# EasyEDA schematic SCH_HexaGlow Neon miner_2023-04-20.json

## Sheets
1 Motherboard: TITLE: Sheet_1; REV: 1.0; Date: 2023-04-19; Sheet: 1/1; Drawn By: abonion1500; Company: Your Company
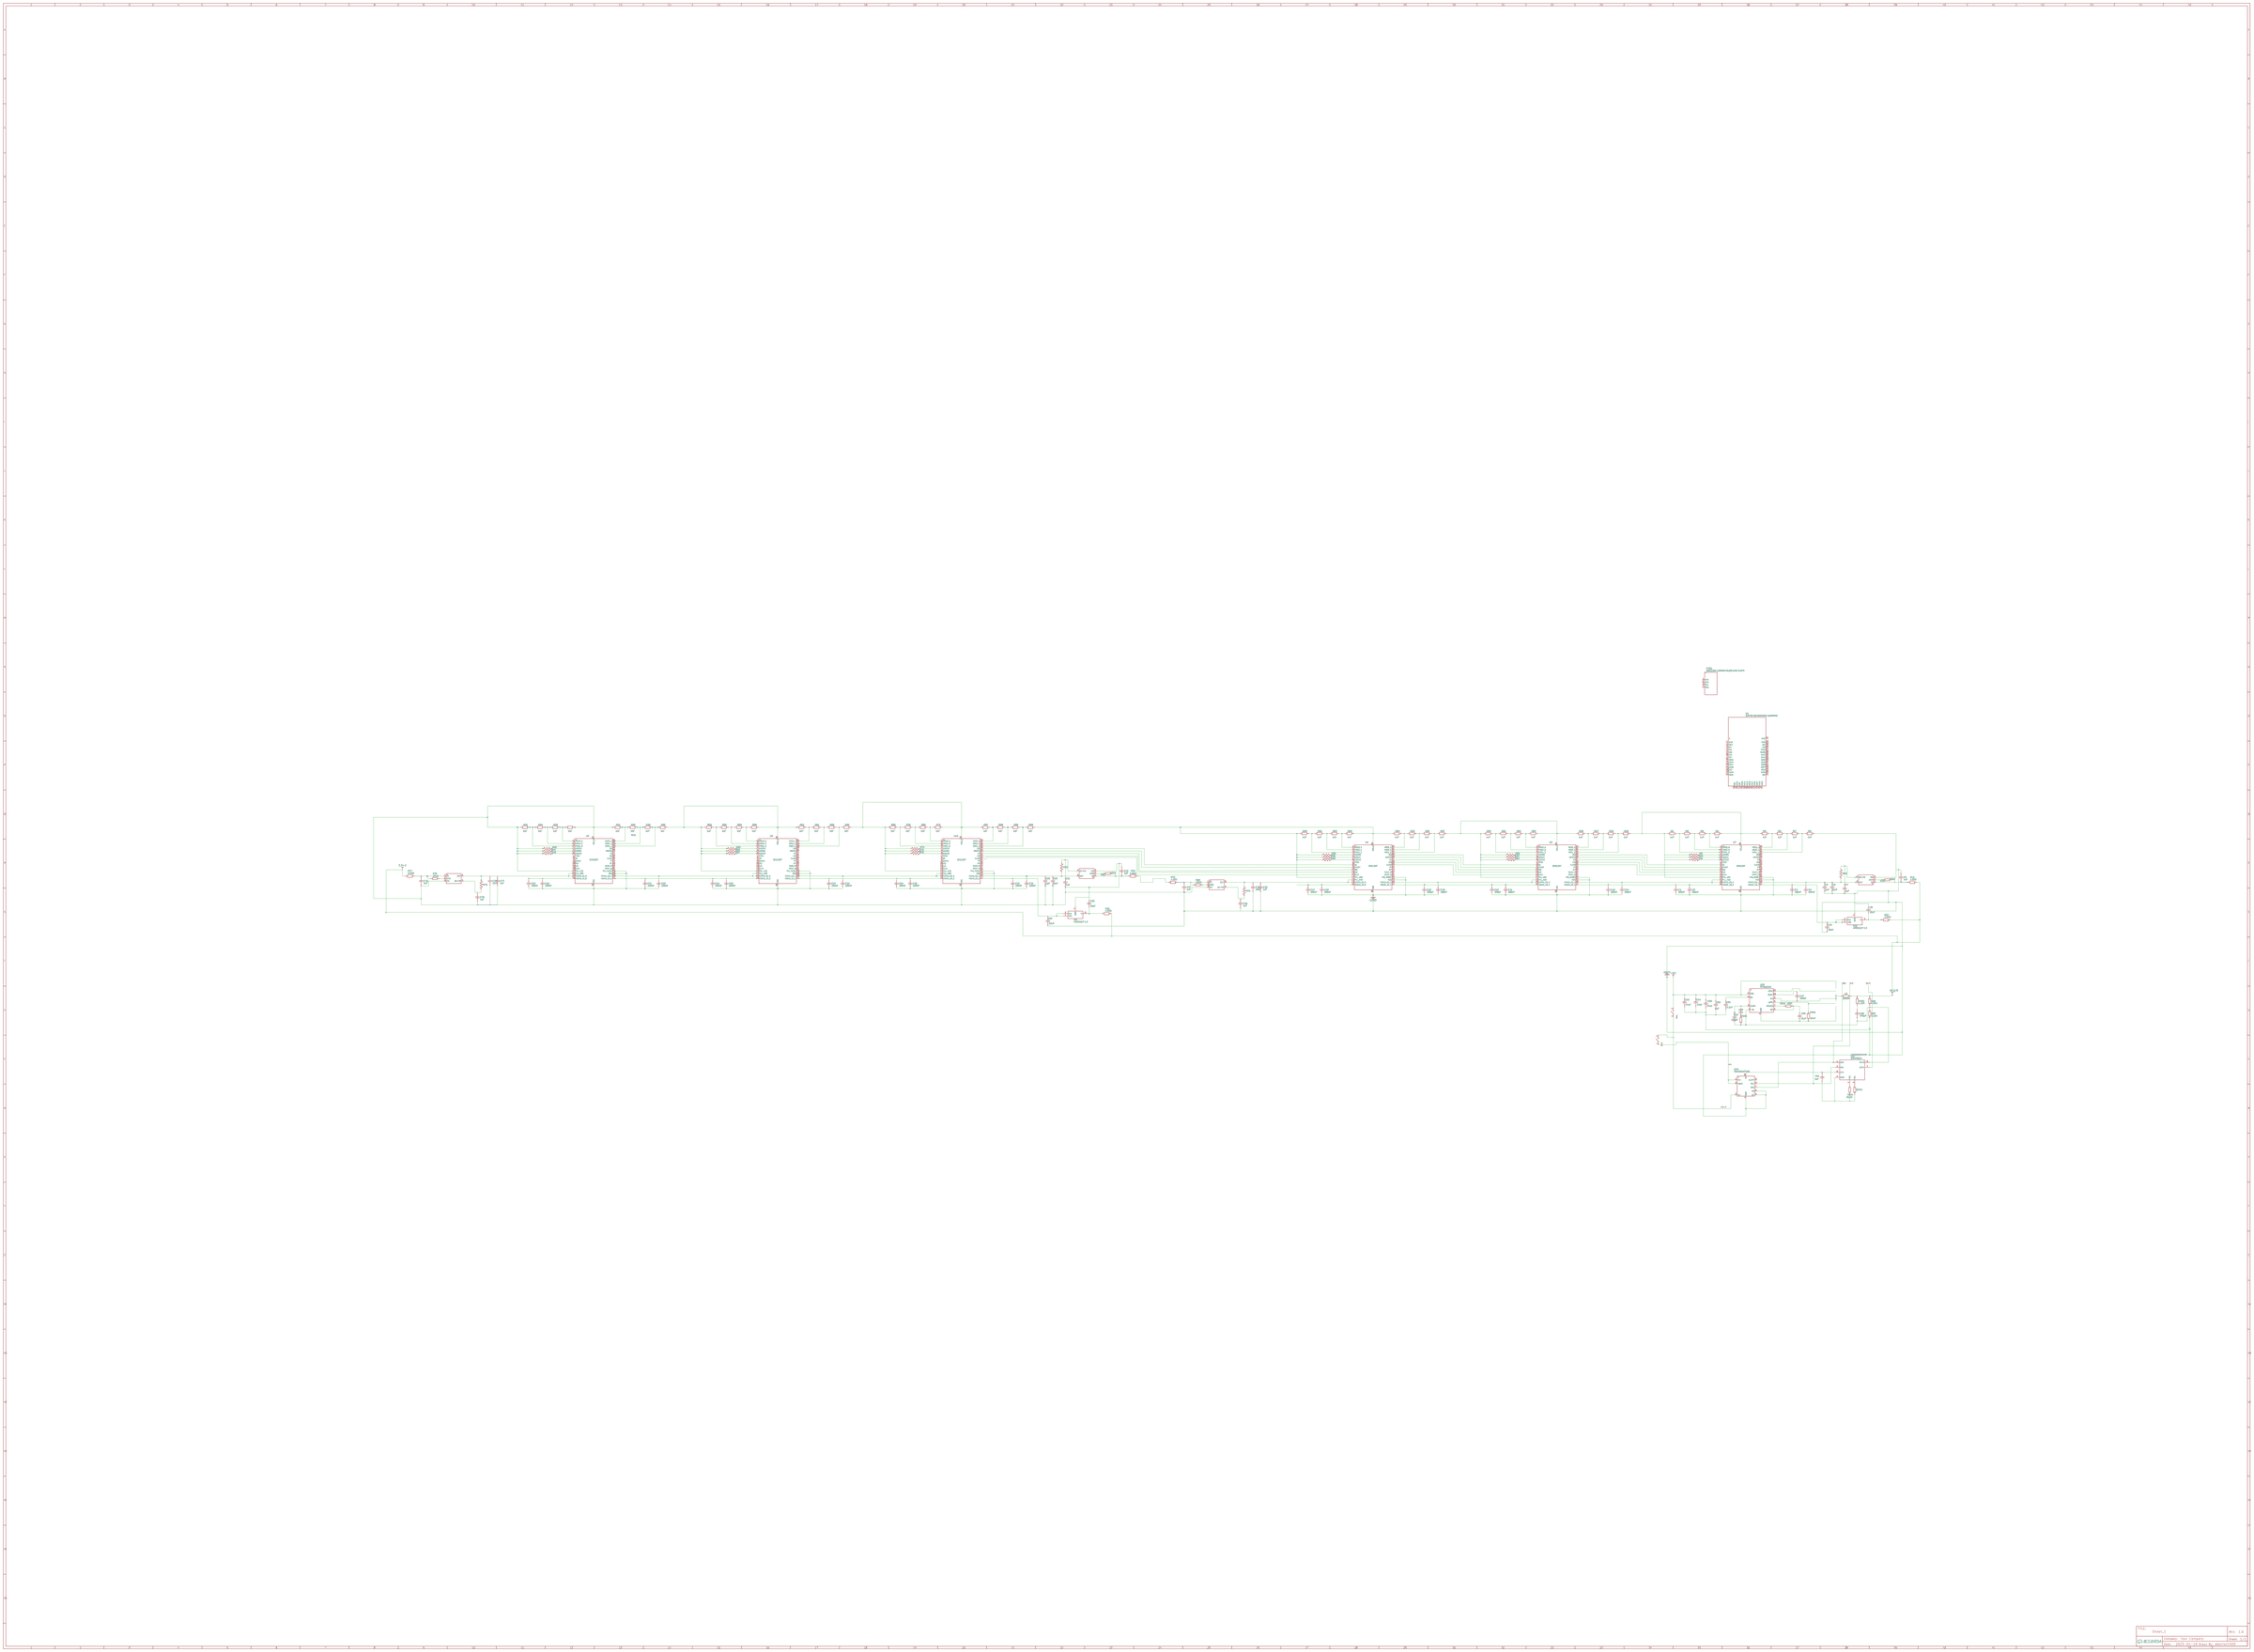
[diagram p0: Motherboard]
2 BM1397: TITLE: BM1397; Date: 2023-04-20; Drawn By: Abonion1500; Company: Abonion1500
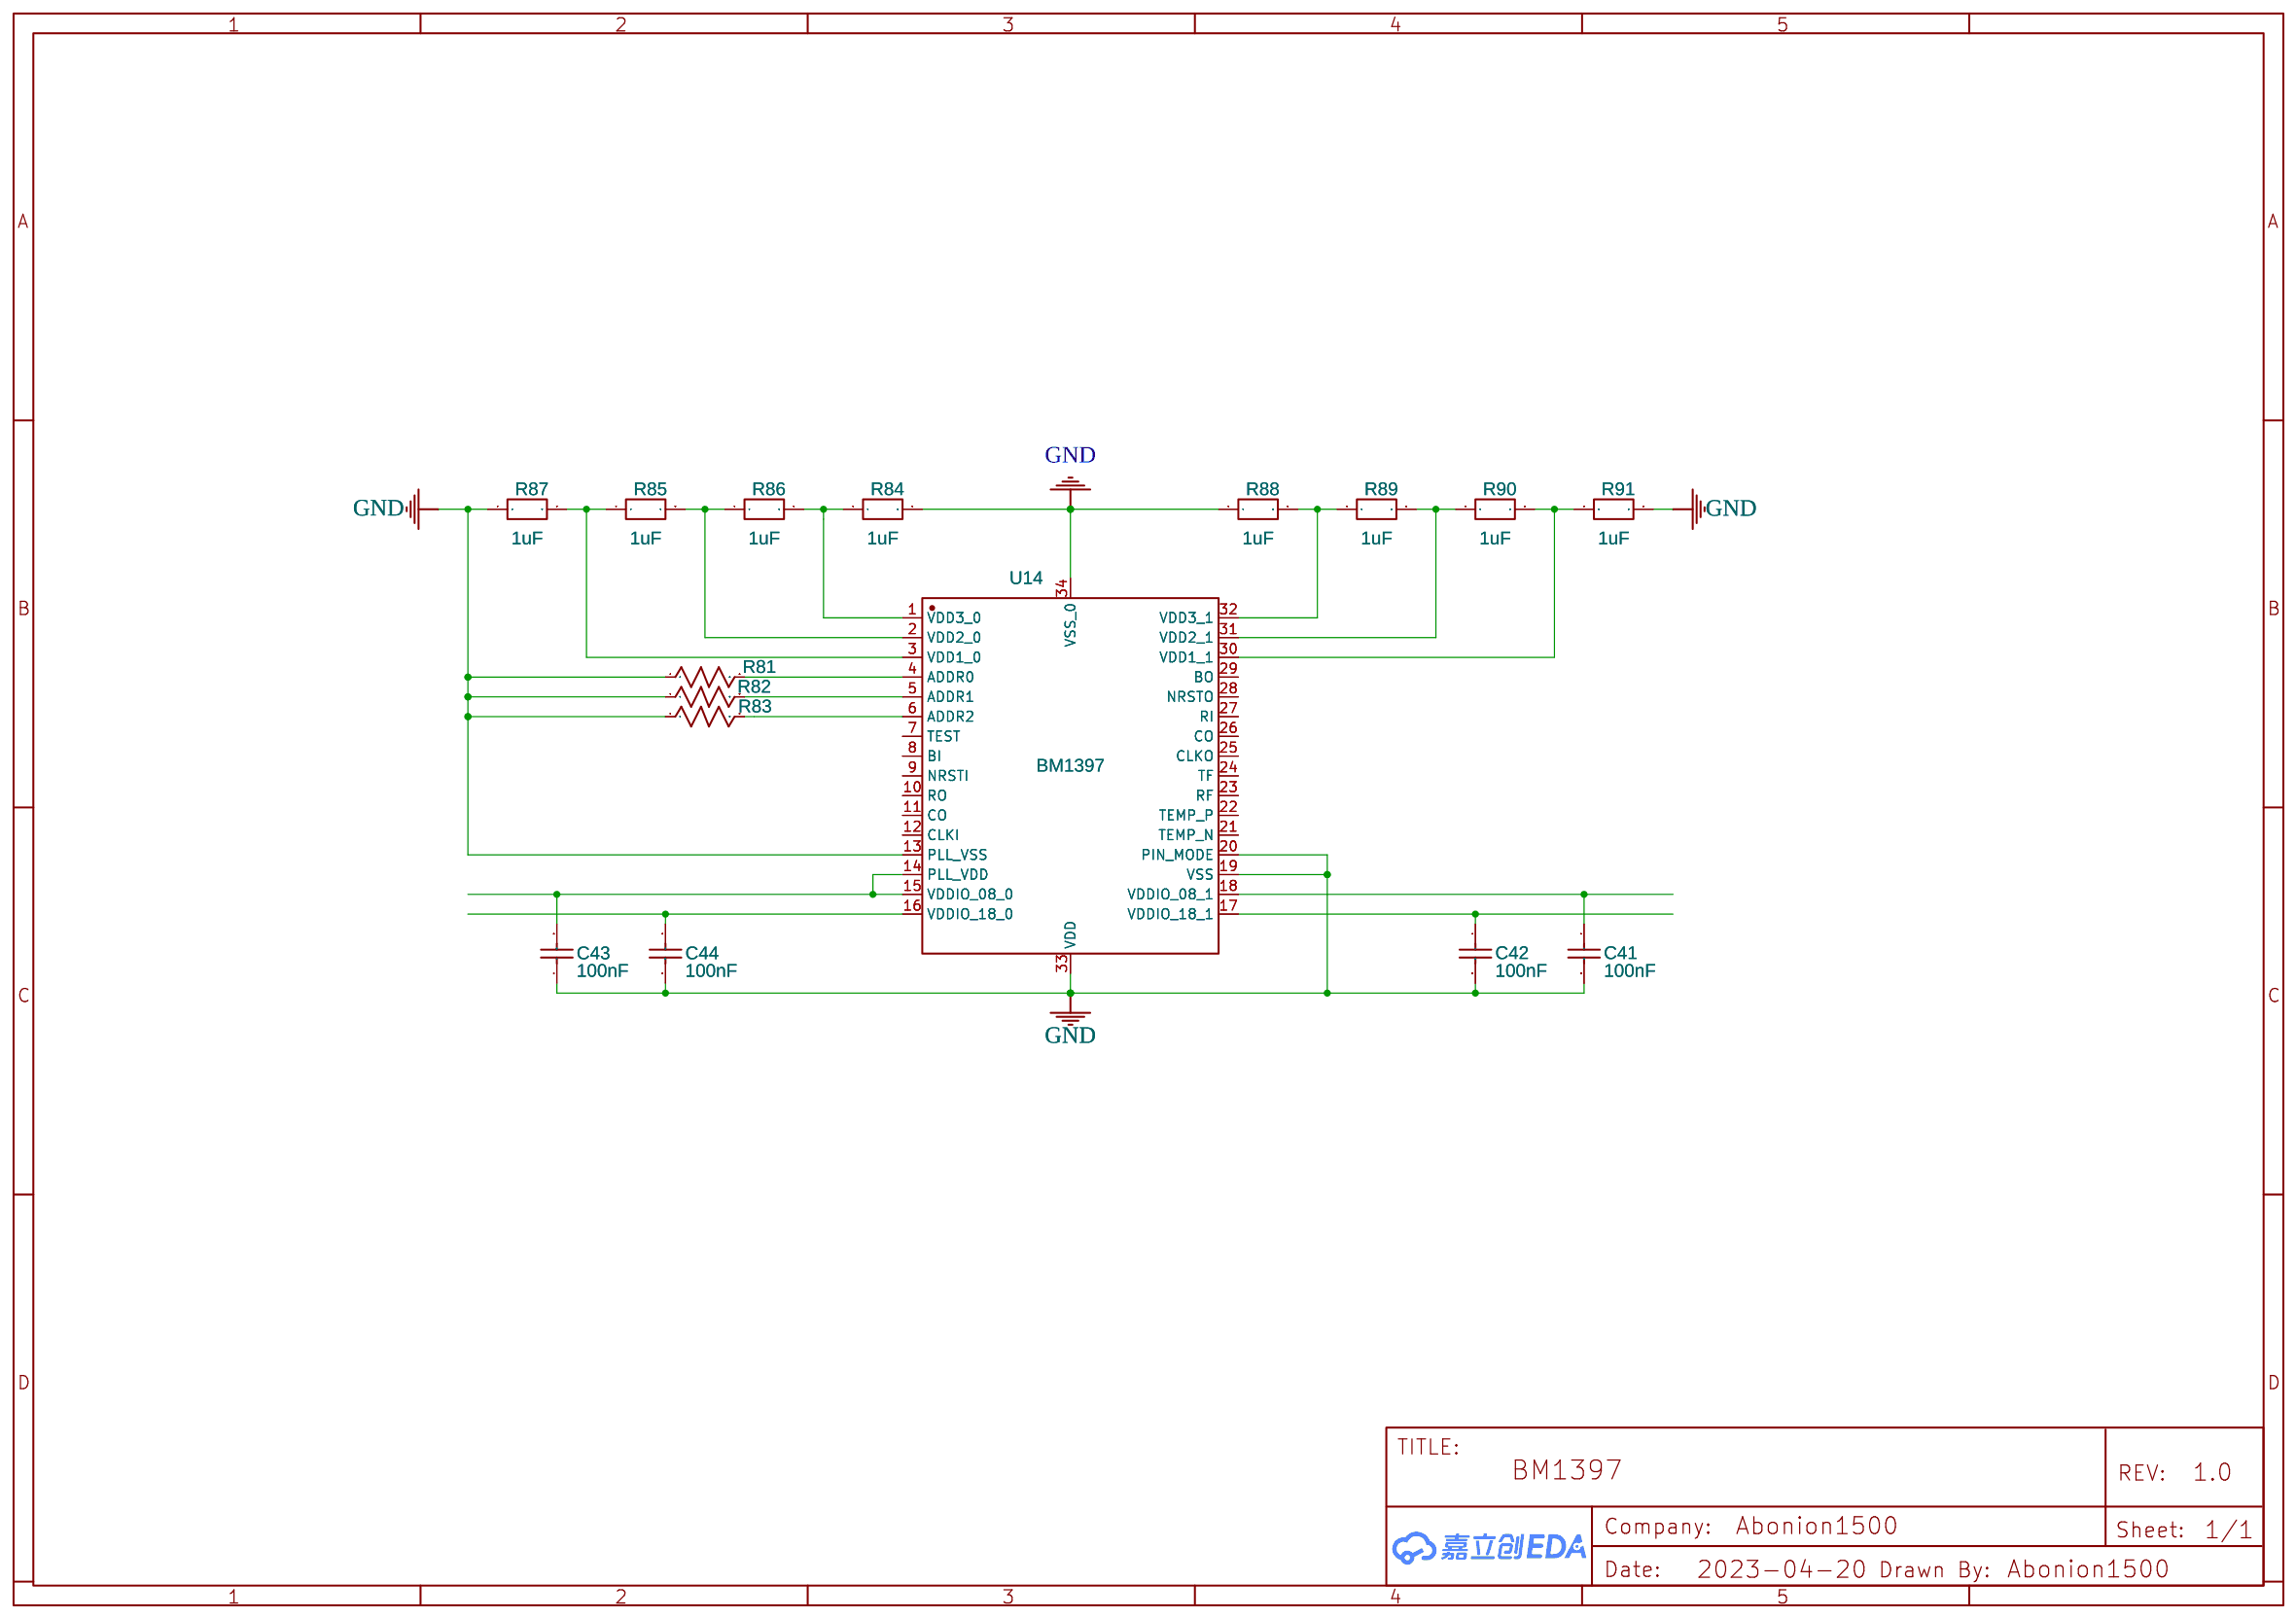
[diagram p1: BM1397]
3 Power: TITLE: Power; Date: 2023-04-20; Drawn By: Abonion1500; Company: Abonion1500
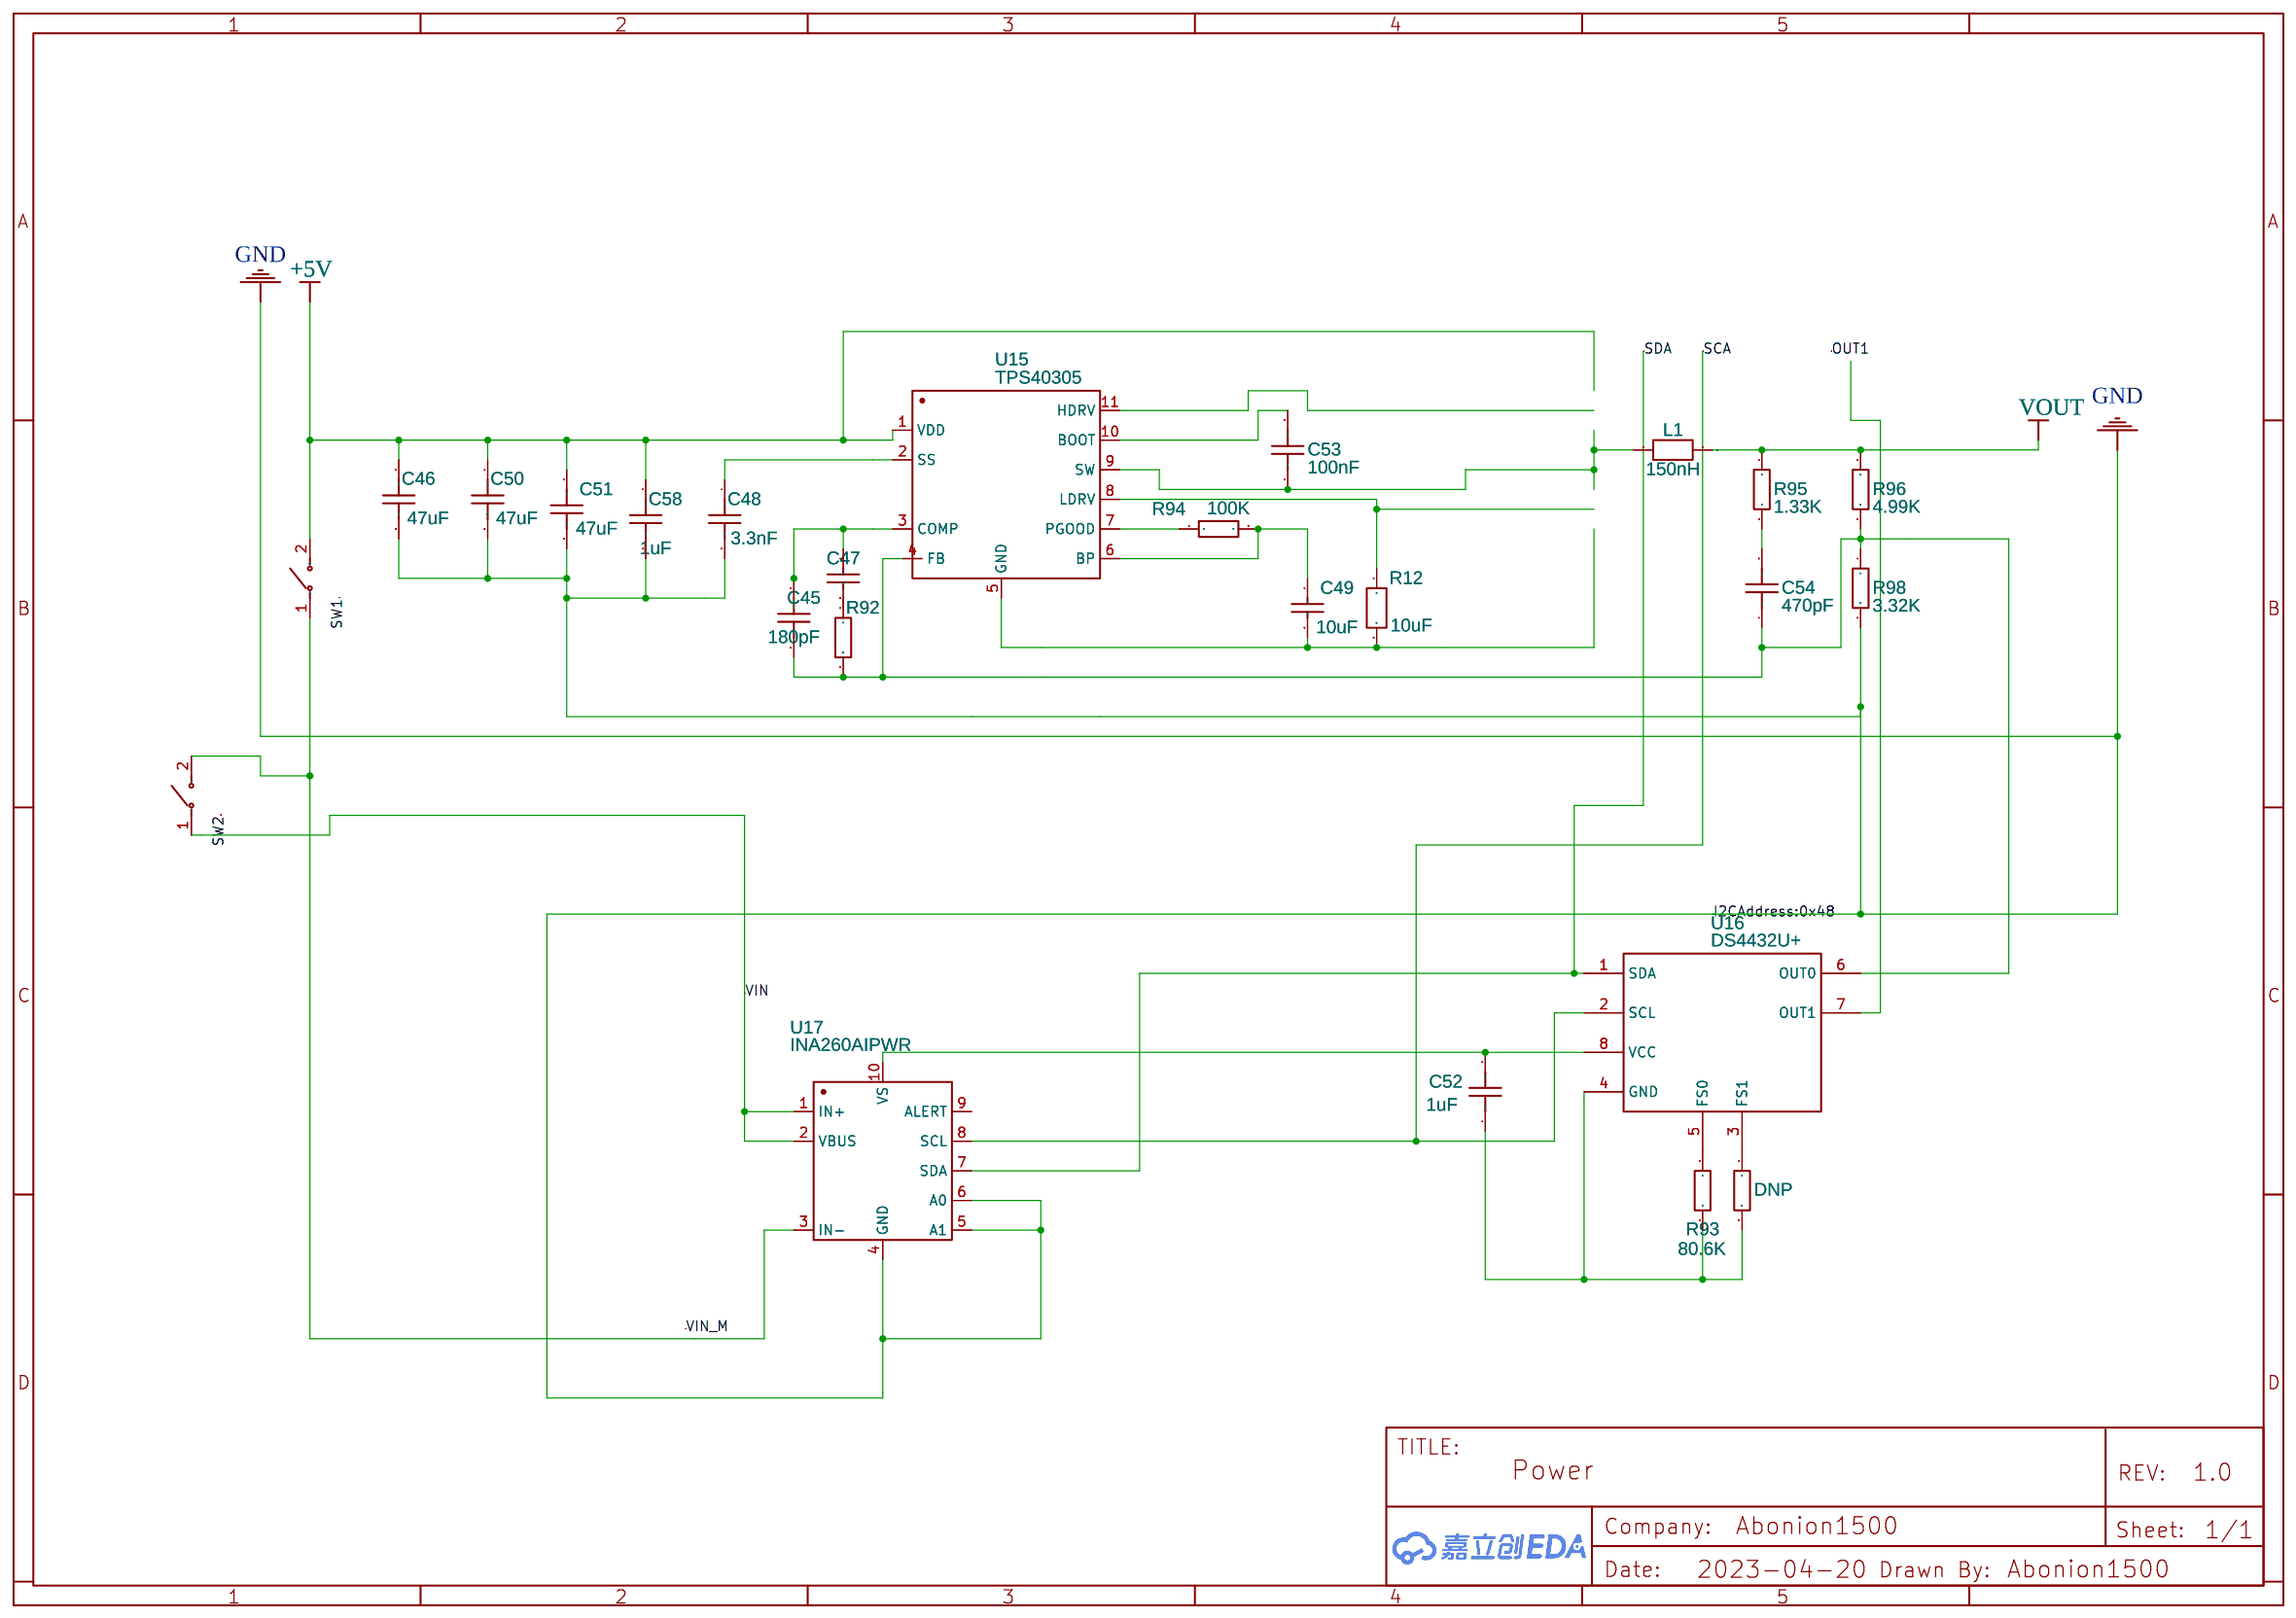
[diagram p2: Power]

## Parts
sheet BM1397
C41  100nF  [C0402]
C42  100nF  [C0402]
C43  100nF  [C0402]
C44  100nF  [C0402]
R81  RMCF0402ZT0R00  [R0402]
R82  RMCF0402ZT0R00  [R0402]
R83  RMCF0402ZT0R00  [R0402]
R84  1uF  [R0402]
R85  1uF  [R0402]
R86  1uF  [R0402]
R87  1uF  [R0402]
R88  1uF  [R0402]
R89  1uF  [R0402]
R90  1uF  [R0402]
R91  1uF  [R0402]
U14  BM1397  [BM1397]
sheet Motherboard
C1  100nF  [C0402]
C2  100nF  [C0402]
C3  100nF  [C0402]
C4  100nF  [C0402]
C5  1uF  [C0402]
C6  10nF  [C0402]
C7  1uF  [C0402]
C8  1uF  [C0402]
C9  10uF  [C0805]
C10  22uF  [C1206]
C11  100nF  [C0402]
C12  100nF  [C0402]
C13  100nF  [C0402]
C14  100nF  [C0402]
C15  100nF  [C0402]
C16  100nF  [C0402]
C17  100nF  [C0402]
C18  100nF  [C0402]
C19  100nF  [C0402]
C20  100nF  [C0402]
C21  100nF  [C0402]
C22  100nF  [C0402]
C23  100nF  [C0402]
C24  100nF  [C0402]
C25  100nF  [C0402]
C26  100nF  [C0402]
C27  22uF  [C1206]
C28  10uF  [C0805]
C29  10nF  [C0402]
C30  1uF  [C0402]
C31  1uF  [C0402]
C32  1uF  [C0402]
C33  100nF  [C0402]
C34  100nF  [C0402]
C35  100nF  [C0402]
C36  100nF  [C0402]
C37  1uF  [C0402]
C38  1uF  [C0402]
C39  10nF  [C0402]
C40  1uF  [C0402]
C55  470pF  [C0805]
C56  10uF  [C0805]
C57  100nF  [C0402]
C59  1.5nF  [C0805]
C60  180pF  [C0805]
C61  1uF  [C0402]
C62  1uF  [C0402]
C63  47uF  [C1210]
C64  47uF  [C1210]
C65  3.3nF  [C0402]
C66  47uF  [C1210]
C76  1uF  [C0402]
C77  1uF  [C0402]
C78  10nF  [C0402]
C79  1uF  [C0402]
DNP1  80.6K  [R0402]
L2  150nH
PCB1  SSD1306-128X64-OLED-0.96 COPY  [SSD1306]
R1  1uF  [R0402]
R2  1uF  [R0402]
R3  1uF  [R0402]
R4  1uF  [R0402]
R5  1uF  [R0402]
R6  1uF  [R0402]
R7  1uF  [R0402]
R8  1uF  [R0402]
R9  RMCF0402ZT0R00  [R0402]
R10  RMCF0402ZT0R00  [R0402]
R11  RMCF0402ZT0R00  [R0402]
R12  RMCF0402ZT0R00  [R0402]
R13  10kΩ  [R1206]
R14  4.99Ω  [R2512]
R15  1uF  [R0402]
R16  1uF  [R0402]
R17  1uF  [R0402]
R18  1uF  [R0402]
R19  1uF  [R0402]
R20  1uF  [R0402]
R21  1uF  [R0402]
R22  1uF  [R0402]
R23  RMCF0402ZT0R00  [R0402]
R24  RMCF0402ZT0R00  [R0402]
R25  RMCF0402ZT0R00  [R0402]
R26  RMCF0402ZT0R00  [R0402]
R27  4.99Ω  [R2512]
R28  RMCF0402ZT0R00  [R0402]
R29  RMCF0402ZT0R00  [R0402]
R30  1uF  [R0402]
R31  1uF  [R0402]
R32  1uF  [R0402]
R33  1uF  [R0402]
R34  1uF  [R0402]
R35  1uF  [R0402]
R36  1uF  [R0402]
R37  1uF  [R0402]
R38  1uF  [R0402]
R39  1uF  [R0402]
R40  1uF  [R0402]
R41  1uF  [R0402]
R42  1uF  [R0402]
R43  1uF  [R0402]
R44  1uF  [R0402]
R45  1uF  [R0402]
R46  RMCF0402ZT0R00  [R0402]
R47  RMCF0402ZT0R00  [R0402]
R48  RMCF0402ZT0R00  [R0402]
R49  1uF  [R0402]
R50  1uF  [R0402]
R51  1uF  [R0402]
R52  1uF  [R0402]
R53  1uF  [R0402]
R54  1uF  [R0402]
R55  1uF  [R0402]
R56  1uF  [R0402]
R57  RMCF0402ZT0R00  [R0402]
R58  RMCF0402ZT0R00  [R0402]
R59  RMCF0402ZT0R00  [R0402]
R60  4.99Ω  [R2512]
R61  10kΩ  [R1206]
R62  RMCF0402ZT0R00  [R0402]
R63  4.99Ω  [R2512]
R64  1uF  [R0402]
R65  1uF  [R0402]
R66  1uF  [R0402]
R67  1uF  [R0402]
R68  1uF  [R0402]
R69  1uF  [R0402]
R70  1uF  [R0402]
R71  1uF  [R0402]
R72  RMCF0402ZT0R00  [R0402]
R73  RMCF0402ZT0R00  [R0402]
R74  RMCF0402ZT0R00  [R0402]
R75  10kΩ  [R1206]
R76  RMCF0402ZT0R00  [R0402]
R77  4.99Ω  [R2512]
R78  4.99Ω  [R2512]
R79  RMCF0402ZT0R00  [R0402]
R80  10kΩ  [R1206]
R97  3.32K  [R0402]
R99  4.99K  [R0402]
R100  1.33K  [R0402]
R101  10uF  [R0402]
R102  100K  [R0402]
R103  3.83K  [R0402]
R104  80.6K  [R0402]
SW3  Switch_Connector  [SWITCH_CONNECTOR]
SW4  Switch_Connector  [SWITCH_CONNECTOR]
U1  ESP32-S3-WROOM-1(N16R8)  [WIRELM-SMD_ESP32-S3-WROOM-1]
U2  SGM2036-0.8YN5G/TR  [SOT-23-5_L2.9-W1.6-P0.95-LS2.8-BR]
U3  BM1397  [BM1397]
U4  BM1397  [BM1397]
U5  BM1397  [BM1397]
U6  BM1397  [BM1397]
U7  BM1397  [BM1397]
U8  AMS1117-1.8  [SOT-223-4_L6.5-W3.5-P2.30-LS7.0-BR]
U9  SGM2036-0.8YN5G/TR  [SOT-23-5_L2.9-W1.6-P0.95-LS2.8-BR]
U10  BM1397  [BM1397]
U11  AMS1117-1.8  [SOT-223-4_L6.5-W3.5-P2.30-LS7.0-BR]
U12  SGM2036-0.8YN5G/TR  [SOT-23-5_L2.9-W1.6-P0.95-LS2.8-BR]
U13  SGM2036-0.8YN5G/TR  [SOT-23-5_L2.9-W1.6-P0.95-LS2.8-BR]
U18  TPS40305
U19  INA260AIPWR
U20  DS4432U+  [USOP-8]
sheet Power
C45  180pF  [C0805]
C46  47uF  [C1210]
C47  1.5nF  [C0805]
C48  3.3nF  [C0402]
C49  10uF  [C0805]
C50  47uF  [C1210]
C51  47uF  [C1210]
C52  1uF  [C0402]
C53  100nF  [C0402]
C54  470pF  [C0805]
C58  1uF  [C0402]
DNP  80.6K  [R0402]
L1  150nH
R12#2  10uF  [R0402]
R92  3.83K  [R0402]
R93  80.6K  [R0402]
R94  100K  [R0402]
R95  1.33K  [R0402]
R96  4.99K  [R0402]
R98  3.32K  [R0402]
SW1  Switch_Connector  [SWITCH_CONNECTOR]
SW2  Switch_Connector  [SWITCH_CONNECTOR]
U15  TPS40305
U16  DS4432U+  [USOP-8]
U17  INA260AIPWR

## Library data of the parts
C1-C4 C11-C26 C33-C36 C41-C44 = CC0402KRX5R7BB104: Supplier: LCSC; Supplier Part: C106204; Manufacturer: YAGEO(国巨); Contributor: LCSC; JLCPCB Part Class: Extended Part
R9-R12 R23-R26 R28 R29 R46-R48 R57-R59 R62 R72-R74 R76 R79 R81-R83 = RMCF0402ZT0R00: Manufacturer: Stackpole Electronics Inc; Supplier: Digi-Key; Supplier Part: RMCF0402ZT0R00CT-ND; link: https://www.digikey.ca/fr/products/detail/stackpole-electronics-inc/RMCF0402ZT0R00/1756905; Contributor: deserresalex
R1-R8 R15-R22 R30-R45 R49-R56 R64-R71 R84-R91 = 0402: Supplier: LCSC; Supplier Part: C730425; Manufacturer: Samsung Electro-Mechanics; Manufacturer Part: CL05A105MO5NNNC; JLCPCB Part Class: Resistor; Contributor: abonion1500; Package Display: No
U3-U7 U10 U14 = BM1397: Contributor: abonion1500
C5 C7 C8 C30-C32 C37 C38 C40 C52 C58 C61 C62 C76 C77 C79 = CGA2B1X7T0G105M050BC: Supplier: LCSC; Supplier Part: C2174522; Manufacturer: TDK; link: https://atta.szlcsc.com/upload/public/pdf/source/20210430/BD8671736ED62E65BA506F30C3AAED50.pdf; Contributor: lcsc
C6 C29 C39 C78 = CC0402KRX7R7BB103: Supplier: LCSC; Supplier Part: C327009; Manufacturer: YAGEO(国巨); Contributor: LCSC; JLCPCB Part Class: Extended Part
C9 C28 C49 C56 = CL21A106KOQNNNE: Supplier: LCSC; Manufacturer: SAMSUNG(三星); Supplier Part: C1713; JLCPCB Part Class: Extended Part
C10 C27 = CL31A226KOHNNNE: Supplier: LCSC; Manufacturer: SAMSUNG(三星); Supplier Part: C90146; JLCPCB Part Class: Extended Part
C54 C55 = 0805B471K500CT: Supplier: LCSC; Supplier Part: C338123; Manufacturer: Walsin(华新科); Contributor: LCSC; JLCPCB Part Class: Extended Part
C53 C57 = 0402X104K100CT: Supplier: LCSC; Supplier Part: C387958; Manufacturer: Walsin(华新科); Contributor: LCSC; JLCPCB Part Class: Extended Part
C47 C59 = CC0805KRX7R9BB152: Supplier: LCSC; Manufacturer: YAGEO(国巨); Supplier Part: C107142; JLCPCB Part Class: Extended Part
C45 C60 = CC0805JRNPO9BN181: Supplier: LCSC; Supplier Part: C113826; Manufacturer: YAGEO(国巨); Contributor: LCSC; JLCPCB Part Class: Extended Part
C46 C50 C51 C63 C64 C66 = GRM32ER61C476KE15L: Supplier: LCSC; Manufacturer: muRata(村田); Supplier Part: C77101; JLCPCB Part Class: Extended Part
C48 C65 = CL05B332KB5NNNC: Supplier: LCSC; Manufacturer: SAMSUNG(三星); Supplier Part: C26404; JLCPCB Part Class: Basic Part
DNP DNP1 R93 R104 = RC0402FR-0780K6L: Supplier: LCSC; Manufacturer: YAGEO(国巨); Contributor: LCSC; Supplier Part: C155698; JLCPCB Part Class: Extended Part; Resistance: 80.6kΩ
L1 L2 = FP1005R1-R15-R: Contributor: abonion1500; Package Display: No
PCB1 = SSD1306-128X64-OLED-0.96 COPY: sourceId: wICUcuL3l
R13 R61 R75 R80 = 1206W4F1002T5E: Supplier: LCSC; Manufacturer: UNI-ROYAL(厚声); Supplier Part: C17902; Resistance (Ohms): 10K; JLCPCB Part Class: Basic Part
R14 R27 R60 R63 R77 R78 = 25121WF499KT4E: Supplier: LCSC; Supplier Part: C406933; Manufacturer: UNI-ROYAL(厚声); Resistance (Ohms): 4.99; Contributor: LCSC; JLCPCB Part Class: Extended Part
R97 R98 = RC0402FR-073K32L: Supplier: LCSC; Manufacturer: YAGEO(国巨); Supplier Part: C137993; JLCPCB Part Class: Extended Part; Resistance: 3.32kΩ
R96 R99 = RC0402FR-074K99L: Supplier: LCSC; Manufacturer: YAGEO(国巨); Supplier Part: C137965; JLCPCB Part Class: Extended Part; Resistance: 4.99kΩ
R95 R100 = RC0402FR-071K33L: Supplier: LCSC; Supplier Part: C276261; Manufacturer: YAGEO(国巨); Contributor: LCSC; Resistance: 1.33kΩ; JLCPCB Part Class: Extended Part
R12#2 R101 = 0402: Supplier: Digi-Key; Supplier Part: C9900015844; Manufacturer: null; JLCPCB Part Class: Extended Part; Contributor: abonion1500
R94 R102 = RC0402JR-07100KL: Supplier: LCSC; Manufacturer: YAGEO(国巨); Supplier Part: C106234; JLCPCB Part Class: Extended Part; Resistance: 100kΩ
R92 R103 = RC0402FR-073K83L: Supplier: LCSC; Supplier Part: C185417; Manufacturer: YAGEO(国巨); Contributor: LCSC; JLCPCB Part Class: Extended Part; Resistance: 3.83kΩ
SW1-SW4 = Switch_Connector: Supplier: LCSC; Supplier Part: C2890356; Manufacturer: G-Switch(品赞); Manufacturer Part: GT-TCB73B-H043-L1; Contributor: sourabh jawalkar
U1 = ESP32-S3-WROOM-1(N16R8): Supplier: LCSC; Supplier Part: C2913202; Manufacturer: ESPRESSIF(乐鑫); Manufacturer Part: ESP32-S3-WROOM-1-N16R8; link: https://atta.szlcsc.com/upload/public/pdf/source/20220705/4E799F39581577F766659887F738A439.pdf; JLCPCB Part Class: Extended Part; Contributor: lcsc
U2 U9 U12 U13 = SGM2036-0.8YN5G/TR: Supplier: LCSC; Supplier Part: C700345; Manufacturer: SGMICRO(圣邦微); link: https://atta.szlcsc.comnull; Contributor: lcsc; JLCPCB Part Class: Extended Part
U8 U11 = AMS1117-1.8: Supplier: LCSC; Manufacturer: AMS; Supplier Part: C6185; JLCPCB Part Class: Extended Part
U15 U18 = TPS40305: Contributor: abonion1500
U17 U19 = INA260AIPWR: Manufacturer: Texas Instruments; Supplier: Digi-Key; Supplier Part: 296-47777-1-ND; Contributor: abonion1500
U16 U20 = DS4432U+: Manufacturer: Maxim Integrated; Supplier: Mouser; Supplier Part: 700-DS4432U; link: https://www.mouser.com/ProductDetail/Maxim-Integrated/DS4432U%2b?qs=sGAEpiMZZMswix2y39yldXm0IcSzou4VXfQNwe0ImdY%3D; Contributor: wheetcracker

## Nets
3.3v-1: R14.1 R27.2 R60.2 R77.1 R95.1 R96.1 R99.1 R100.1
+5V: C46.1 C50.1 C51.1 C58.2 C62.2 C63.1 C64.1 C66.1 SW2.2 SW3.2 U15.1(VDD) U18.1(VDD)
GND: C1.1 C2.1 C3.2 C4.2 C5.2 C6.1 C7.2 C8.1 C9.2 C10.1 C11.1 C12.1 C13.2 C14.2 C15.2 C16.2 C17.1 C18.1 C19.1 C20.1 C21.2 C22.2 C23.1 C24.1 C25.2 C26.2 C27.1 C28.2 C29.1 C30.2 C31.2 C32.1 C33.1 C34.1 C35.2 C36.2 C37.1 C38.1 C39.2 C40.1 C41.2 C42.2 C43.1 C44.1 C46.2 C48.2 C50.2 C51.2 C58.1 C62.1 C63.2 C64.2 C65.2 C66.2 C76.1 C77.1 C78.2 C79.1 R8.2 R41.1 R42.1 R45.2 R46.1 R47.1 R48.1 R81.1 R82.1 R83.1 R84.2 R87.1 R88.1 R91.2 R97.2 R98.2 U2.3(EN) U3.19(VSS) U3.20(PIN_MODE) U3.33(VDD) U4.19(VSS) U4.20(PIN_MODE) U4.33(VDD) U5.13(PLL_VSS) U5.19(VSS) U5.20(PIN_MODE) U5.33(VDD) U5.34(VSS_0) U6.19(VSS) U6.20(PIN_MODE) U6.33(VDD) U7.19(VSS) U7.20(PIN_MODE) U7.33(VDD) U8.1(GND) U9.3(EN) U10.19(VSS) U10.20(PIN_MODE) U10.33(VDD) U11.1(GND) U12.3(EN) U13.3(EN) U14.13(PLL_VSS) U14.19(VSS) U14.20(PIN_MODE) U14.33(VDD) U14.34(VSS_0) U17.4(GND) U17.5(A1) U17.6(A0) U19.4(GND) U19.5(A1) U19.6(A0)
VIN: SW1.1 SW4.1 U17.1(IN+) U17.2(VBUS) U19.1(IN+) U19.2(VBUS)
SCA: U16.2(SCL) U17.8(SCL) U19.8(SCL) U20.2(SCL)
SDA: U16.1(SDA) U17.7(SDA) U19.7(SDA) U20.1(SDA)
Net-(C1-2): C1.2 C2.2 C13.1 U3.17(VDDIO_18_1) U7.16(VDDIO_18_0)
Net-(C3-1): C3.1 C10.2 U7.17(VDDIO_18_1) U11.2(Out) U11.4(TAB)
Net-(C4-1): C4.1 C5.1 C6.2 R12.2 U2.5(OUT) U7.18(VDDIO_08_1)
Net-(C7-1): C7.1 R12.1 U2.4(BP/FB)
Net-(C8-2): C8.2 R13.1 R14.2 U2.1(IN)
Net-(C9-1): C9.1 R27.1 U11.3(In)
Net-(C11-2): C11.2 C12.2 C16.1 U3.16(VDDIO_18_0) U4.17(VDDIO_18_1)
Net-(C14-1): C14.1 U3.18(VDDIO_08_1) U7.14(PLL_VDD) U7.15(VDDIO_08_0)
Net-(C15-1): C15.1 U3.14(PLL_VDD) U3.15(VDDIO_08_0) U4.18(VDDIO_08_1)
Net-(C17-2): C17.2 C18.2 U4.16(VDDIO_18_0)
Net-(C19-2): C19.2 C20.2 U5.16(VDDIO_18_0)
Net-(C21-1): C21.1 C23.2 C24.2 U5.17(VDDIO_18_1) U6.16(VDDIO_18_0)
Net-(C22-1): C22.1 U5.18(VDDIO_08_1) U6.14(PLL_VDD) U6.15(VDDIO_08_0)
Net-(C25-1): C25.1 C33.2 C34.2 U6.17(VDDIO_18_1) U10.16(VDDIO_18_0)
Net-(C26-1): C26.1 U6.18(VDDIO_08_1) U10.14(PLL_VDD) U10.15(VDDIO_08_0)
Net-(C27-2): C27.2 C35.1 U8.2(Out) U8.4(TAB) U10.17(VDDIO_18_1)
Net-(C28-1): C28.1 R60.1 U8.3(In)
Net-(C31-1): C31.1 R62.1 U9.4(BP/FB)
Net-(C32-2): C32.2 R61.1 R63.2 U9.1(IN)
Net-(C36-1): C36.1 R62.2 U9.5(OUT) U10.18(VDDIO_08_1)
Net-(C37-2): C37.2 R78.2 R80.1 U13.1(IN)
Net-(C41-1): C41.1 U14.18(VDDIO_08_1)
Net-(C42-1): C42.1 U14.17(VDDIO_18_1)
Net-(C43-2): C43.2 U14.14(PLL_VDD) U14.15(VDDIO_08_0)
Net-(C44-2): C44.2 U14.16(VDDIO_18_0)
Net-(C45-1): C45.1 C47.1 U15.3(COMP)
Net-(C45-2): C45.2 C54.1 R92.2 R96.2 R98.1 U15.4(FB) U16.6(OUT0)
Net-(C47-2): C47.2 R92.1
Net-(C48-1): C48.1 U15.2(SS)
Net-(C49-1): C49.1 R94.2 U15.6(BP)
Net-(C49-2): C49.2 R12#2.2 U15.5(GND)
Net-(C52-1): C52.1 DNP.2 R93.2 U16.4(GND)
Net-(C52-2): C52.2 U16.8(VCC) U17.10(VS)
Net-(C53-1): C53.1 U15.9(SW)
Net-(C53-2): C53.2 U15.10(BOOT)
Net-(C54-2): C54.2 R95.2
Net-(C55-1): C55.1 C60.2 R97.1 R99.2 R103.2 U18.4(FB) U20.6(OUT0)
Net-(C55-2): C55.2 R100.2
Net-(C56-1): C56.1 R102.2 U18.6(BP)
Net-(C56-2): C56.2 R101.2 U18.5(GND)
Net-(C57-1): C57.1 U18.9(SW)
Net-(C57-2): C57.2 U18.10(BOOT)
Net-(C59-1): C59.1 C60.1 U18.3(COMP)
Net-(C59-2): C59.2 R103.1
Net-(C61-1): C61.1 DNP1.2 R104.2 U20.4(GND)
Net-(C61-2): C61.2 U19.10(VS) U20.8(VCC)
Net-(C65-1): C65.1 U18.2(SS)
Net-(C76-2): C76.2 R75.1 R77.2 U12.1(IN)
Net-(DNP1-1): DNP1.1 U20.3(FS1)
Net-(DNP-1): DNP.1 U16.3(FS1)
Net-(R1-1): R1.1 R4.2 R5.1 R15.2 U7.13(PLL_VSS) U7.34(VSS_0)
Net-(R1-2): R1.2 R2.1 U7.3(VDD1_0)
Net-(R2-2): R2.2 R3.1 U7.2(VDD2_0)
Net-(R3-2): R3.2 R4.1 U7.1(VDD3_0)
Net-(R5-2): R5.2 R6.1 U7.32(VDD3_1)
Net-(R6-2): R6.2 R7.1 U7.31(VDD2_1)
Net-(R7-2): R7.2 R8.1 U7.30(VDD1_1)
Net-(R9-2): R9.2 U7.4(ADDR0)
Net-(R10-2): R10.2 U7.5(ADDR1)
Net-(R11-2): R11.2 U7.6(ADDR2)
Net-(R12#2-1): R12#2.1 U15.8(LDRV)
Net-(R13-2): R13.2 U2.2(GND)
Net-(R15-1): R15.1 R16.2 U3.30(VDD1_1)
Net-(R16-1): R16.1 R17.2 U3.31(VDD2_1)
Net-(R17-1): R17.1 R18.2 U3.32(VDD3_1)
Net-(R18-1): R18.1 R19.1 R22.2 R23.1 R24.1 R25.1 R37.2 U3.13(PLL_VSS) U3.34(VSS_0)
Net-(R19-2): R19.2 R21.1 U3.3(VDD1_0)
Net-(R20-1): R20.1 R21.2 U3.2(VDD2_0)
Net-(R20-2): R20.2 R22.1 U3.1(VDD3_0)
Net-(R23-2): R23.2 U3.6(ADDR2)
Net-(R24-2): R24.2 U3.5(ADDR1)
Net-(R25-2): R25.2 U3.4(ADDR0)
Net-(R26-1): R26.1 R28.1 R29.1 R30.2 R33.1 R34.1 R64.2 U4.13(PLL_VSS) U4.34(VSS_0)
Net-(R26-2): R26.2 U4.4(ADDR0)
Net-(R28-2): R28.2 U4.5(ADDR1)
Net-(R29-2): R29.2 U4.6(ADDR2)
Net-(R30-1): R30.1 R32.2 U4.1(VDD3_0)
Net-(R31-1): R31.1 R33.2 U4.3(VDD1_0)
Net-(R31-2): R31.2 R32.1 U4.2(VDD2_0)
Net-(R34-2): R34.2 R35.1 U4.32(VDD3_1)
Net-(R35-2): R35.2 R36.1 U4.31(VDD2_1)
Net-(R36-2): R36.2 R37.1 U4.30(VDD1_1)
Net-(R38-1): R38.1 R39.2 U5.30(VDD1_1)
Net-(R38-2): R38.2 R52.1 R53.1 R56.2 R57.1 R58.1 R59.1 U6.13(PLL_VSS) U6.34(VSS_0)
Net-(R39-1): R39.1 R40.2 U5.31(VDD2_1)
Net-(R40-1): R40.1 R41.2 U5.32(VDD3_1)
Net-(R42-2): R42.2 R44.1 U5.3(VDD1_0)
Net-(R43-1): R43.1 R44.2 U5.2(VDD2_0)
Net-(R43-2): R43.2 R45.1 U5.1(VDD3_0)
Net-(R46-2): R46.2 U5.6(ADDR2)
Net-(R47-2): R47.2 U5.5(ADDR1)
Net-(R48-2): R48.2 U5.4(ADDR0)
Net-(R49-1): R49.1 R50.2 U6.30(VDD1_1)
Net-(R49-2): R49.2 R67.1 R71.2 U10.34(VSS_0)
Net-(R50-1): R50.1 R51.2 U6.31(VDD2_1)
Net-(R51-1): R51.1 R52.2 U6.32(VDD3_1)
Net-(R53-2): R53.2 R55.1 U6.3(VDD1_0)
Net-(R54-1): R54.1 R55.2 U6.2(VDD2_0)
Net-(R54-2): R54.2 R56.1 U6.1(VDD3_0)
Net-(R57-2): R57.2 U6.6(ADDR2)
Net-(R58-2): R58.2 U6.5(ADDR1)
Net-(R59-2): R59.2 U6.4(ADDR0)
Net-(R61-2): R61.2 U9.2(GND)
Net-(R63-1): R63.1 R78.1
Net-(R64-1): R64.1 R65.2 U10.30(VDD1_1)
Net-(R65-1): R65.1 R66.2 U10.31(VDD2_1)
Net-(R66-1): R66.1 R67.2 U10.32(VDD3_1)
Net-(R68-1): R68.1 R72.1 R73.1 R74.1 U10.13(PLL_VSS)
Net-(R68-2): R68.2 R70.1 U10.3(VDD1_0)
Net-(R69-1): R69.1 R70.2 U10.2(VDD2_0)
Net-(R69-2): R69.2 R71.1 U10.1(VDD3_0)
Net-(R72-2): R72.2 U10.6(ADDR2)
Net-(R73-2): R73.2 U10.5(ADDR1)
Net-(R74-2): R74.2 U10.4(ADDR0)
Net-(R75-2): R75.2 U12.2(GND)
Net-(R76-1): R76.1 U12.4(BP/FB)
Net-(R76-2): R76.2 U5.14(PLL_VDD) U5.15(VDDIO_08_0) U12.5(OUT)
Net-(R79-1): R79.1 U13.4(BP/FB)
Net-(R79-2): R79.2 U4.14(PLL_VDD) U4.15(VDDIO_08_0) U13.5(OUT)
Net-(R80-2): R80.2 U13.2(GND)
Net-(R81-2): R81.2 U14.4(ADDR0)
Net-(R82-2): R82.2 U14.5(ADDR1)
Net-(R83-2): R83.2 U14.6(ADDR2)
Net-(R84-1): R84.1 R86.2 U14.1(VDD3_0)
Net-(R85-1): R85.1 R87.2 U14.3(VDD1_0)
Net-(R85-2): R85.2 R86.1 U14.2(VDD2_0)
Net-(R88-2): R88.2 R89.1 U14.32(VDD3_1)
Net-(R89-2): R89.2 R90.1 U14.31(VDD2_1)
Net-(R90-2): R90.2 R91.1 U14.30(VDD1_1)
Net-(R93-1): R93.1 U16.5(FS0)
Net-(R94-1): R94.1 U15.7(PGOOD)
Net-(R101-1): R101.1 U18.8(LDRV)
Net-(R102-1): R102.1 U18.7(PGOOD)
Net-(R104-1): R104.1 U20.5(FS0)
Net-(SW1-2): SW1.2 SW2.1 U17.3(IN-)
Net-(SW3-1): SW3.1 SW4.2 U19.3(IN-)
Net-(U3-8): U3.8(BI) U4.29(BO)
Net-(U3-9): U3.9(NRSTI) U4.28(NRSTO)
Net-(U3-10): U3.10(RO) U4.27(RI)
Net-(U3-11): U3.11(CO) U4.26(CO)
Net-(U3-12): U3.12(CLKI) U4.25(CLKO)
Net-(U3-25): U3.25(CLKO) U7.12(CLKI)
Net-(U3-26): U3.26(CO) U7.11(CO)
Net-(U3-27): U3.27(RI) U7.10(RO)
Net-(U3-28): U3.28(NRSTO) U7.9(NRSTI)
Net-(U3-29): U3.29(BO) U7.8(BI)
Net-(U4-8): U4.8(BI) U10.29(BO)
Net-(U4-9): U4.9(NRSTI) U10.28(NRSTO)
Net-(U4-10): U4.10(RO) U10.27(RI)
Net-(U4-11): U4.11(CO) U10.26(CO)
Net-(U4-12): U4.12(CLKI) U10.25(CLKO)

Not connected (* = marked no-connect by the designer): C29 2; C30 1; C38 2; C39 1; C40 2; C77 2; C78 1; C79 2; L1 1 2; L2 1 2; PCB1 1(VCC) 2(GND) 3(SCL) 4(SDA); R9 1; R10 1; R11 1; U1 1(GND) 2(3V3) 3(EN) 4(IO4) 5(IO5) 6(IO6) 7(IO7) 8(IO15) 9(IO16) 10(IO17) 11(IO18) 12(IO8) 13(IO19) 14(IO20) 15(IO3) 16(IO46) 17(IO9) 18(IO10) 19(IO11) 20(IO12) 21(IO13) 22(IO14) 23(IO21) 24(IO47) 25(IO48) 26(IO45) 27(IO0) 28(IO35) 29(IO36) 30(IO37) 31(IO38) 32(IO39) 33(IO40) 34(IO41) 35(IO42) 36(RXD0) 37(TXD0) 38(IO2) 39(IO1) 40(GND) 41(GND); U3 7(TEST) 21(TEMP_N) 22(TEMP_P) 23(RF) 24(TF); U4 7(TEST) 21(TEMP_N) 22(TEMP_P) 23(RF) 24(TF); U5 7(TEST) 8(BI) 9(NRSTI) 10(RO) 11(CO) 12(CLKI) 21(TEMP_N) 22(TEMP_P) 23(RF) 24(TF) 25(CLKO) 26(CO) 27(RI) 28(NRSTO) 29(BO); U6 7(TEST) 8(BI) 9(NRSTI) 10(RO) 11(CO) 12(CLKI) 21(TEMP_N) 22(TEMP_P) 23(RF) 24(TF) 25(CLKO) 26(CO) 27(RI) 28(NRSTO) 29(BO); U7 7(TEST) 21(TEMP_N) 22(TEMP_P) 23(RF) 24(TF) 25(CLKO) 26(CO) 27(RI) 28(NRSTO) 29(BO); U10 7(TEST) 8(BI) 9(NRSTI) 10(RO) 11(CO) 12(CLKI) 21(TEMP_N) 22(TEMP_P) 23(RF) 24(TF); U14 7(TEST) 8(BI) 9(NRSTI) 10(RO) 11(CO) 12(CLKI) 21(TEMP_N) 22(TEMP_P) 23(RF) 24(TF) 25(CLKO) 26(CO) 27(RI) 28(NRSTO) 29(BO); U15 11(HDRV); U16 7(OUT1); U17 9(ALERT); U18 11(HDRV); U19 9(ALERT); U20 7(OUT1)
